# EasyEDA schematic habsat2-sstv-board.json
TITLE: Sheet_1; REV: 1.0; Date: 2023-02-08; Sheet: 2/2; Drawn By: Arkadiusz Papaj; Company: CosmoPK
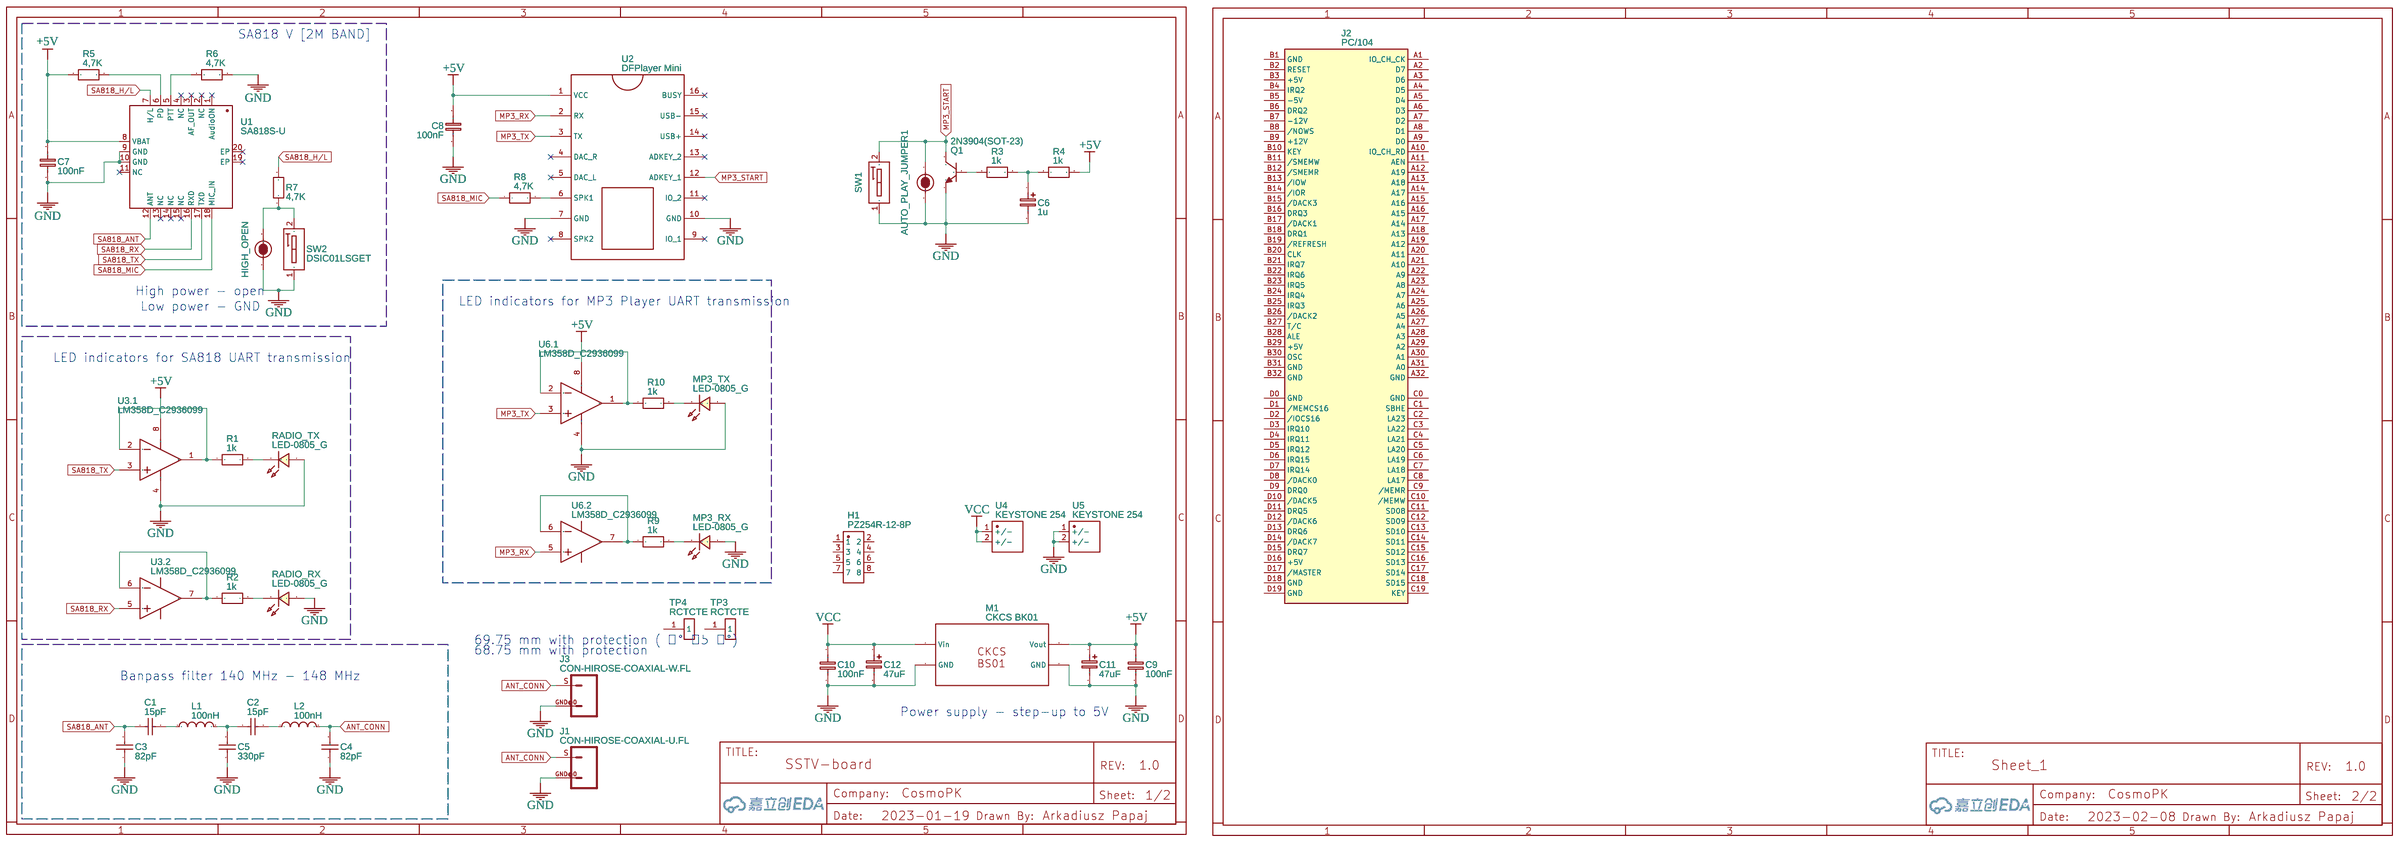
[diagram p0: schematic sheet]

## Parts
AUTO_PLAY_JUMPER1  JUMPER-PAD-2-NC_BY_PASTEFULL-BOX-SILK  [PAD-JUMPER-2-NC_BY_PASTE_YES_SILK_FULL_BOX]
C1  15pF  [C0805]
C2  15pF  [C0805]
C3  82pF  [C0805]
C4  82pF  [C0805]
C5  330pF  [C0805]
C6  1u  [CASE-B_3528]
C7  100nF  [C0805]
C8  100nF  [C0805]
C9  100nF  [C0805]
C10  100nF  [C0805]
C11  47uF  [CASE-B_3528]
C12  47uF  [CASE-B_3528]
H1  PZ254R-12-8P  [HDR-TH_8P-P2.54-H-M-R2-C4-S2.54]
HIGH_OPEN  JUMPER-PAD-2-NC_BY_PASTEFULL-BOX-SILK  [PAD-JUMPER-2-NC_BY_PASTE_YES_SILK_FULL_BOX]
J1  CON-HIROSE-COAXIAL-U.FL  [CON-U.FL]
J2  PC/104  [PC/104]
J3  CON-HIROSE-COAXIAL-W.FL  [CON-W.FL]
L1  100nH  [L1008]
L2  100nH  [L1008]
M1  CKCS BK01  [CKCS_BS01]
MP3_RX  LED-0805_G  [LED0805_GREEN]
MP3_TX  LED-0805_G  [LED0805_GREEN]
Q1  2N3904(SOT-23)  [SOT-23-3_L2.9-W1.3-P1.90-LS2.4-TR]
R1  1k  [R0805]
R2  1k  [R0805]
R3  1k  [R0805]
R4  1k  [R0805]
R5  4,7K  [R0805]
R6  4,7K  [R0805]
R7  4,7K  [R0805]
R8  4,7K  [R0805]
R9  1k  [R0805]
R10  1k  [R0805]
RADIO_RX  LED-0805_G  [LED0805_GREEN]
RADIO_TX  LED-0805_G  [LED0805_GREEN]
SW1  DSIC01LSGET  [SW-SMD_DSIC01LSGET]
SW2  DSIC01LSGET  [SW-SMD_DSIC01LSGET]
TP3  RCTCTE  [SMD-1_L2.0-W1.25-C172771]
TP4  RCTCTE  [SMD-1_L2.0-W1.25-C172771]
U1  SA818S-U  [WIRELM-SMD_G-NICERF_SA818S-X]
U2  DFPlayer Mini  [DF PLAYER MINI]
U3  LM358D_C2936099  [SO-8_L4.9-W3.9-P1.27-LS5.9-BL]  (sections 1,2)
U4  KEYSTONE 254  [BAT-SMD_MY-18650-02]
U5  KEYSTONE 254  [BAT-SMD_MY-18650-02]
U6  LM358D_C2936099  [SO-8_L4.9-W3.9-P1.27-LS5.9-BL]  (sections 1,2)

## Library data of the parts
AUTO_PLAY_JUMPER1 HIGH_OPEN = JUMPER-PAD-2-NC_BY_PASTEFULL-BOX-SILK: Contributor: SparkFun
C1 C2 = CL21C150JBANNNC: Supplier: LCSC; Manufacturer: SAMSUNG(三星); Supplier Part: C1794; JLCPCB Part Class: Extended Part
C3 C4 = 0805CG820J500NT: Supplier: LCSC; Manufacturer: FH(风华); Supplier Part: C1841; JLCPCB Part Class: Extended Part
C5 = 0805B331K500NT: Supplier: LCSC; Manufacturer: FH(风华); Supplier Part: C1737; JLCPCB Part Class: Extended Part
C6 C11 C12 = C_Tan_SMD_B_EU: Contributor: LCEDA_Lib
C7-C10 = C_0805_EU: Contributor: LCEDA_Lib
H1 = PZ254R-12-8P: Supplier: LCSC; Supplier Part: C492432; Manufacturer: XFCN(兴飞); Contributor: LCSC; JLCPCB Part Class: Extended Part
J1 = CON-HIROSE-COAXIAL-U.FL
J2 = PC/104: Contributor: andrey.shurmin
J3 = CON-HIROSE-COAXIAL-W.FL
L1 L2 = NLV25T-R10J-PF: Supplier: LCSC; Manufacturer: TDK; Supplier Part: C88522; JLCPCB Part Class: Extended Part
M1 = CKCS BK01: Contributor: detAmend
MP3_RX RADIO_RX RADIO_TX = LED-0805_G: Manufacturer: 国星光电; Manufacturer Part: NCD0805G1; Supplier Part: C84260; Contributor: LCEDA_Lib
MP3_TX = LED-0805_G: Manufacturer: 国星光电; Manufacturer Part: NCD0805G1; Supplier Part: C84260; Contributor: LCEDA_Lib; Package Display: No
Q1 = 2N3904(SOT-23): Supplier: LCSC; Manufacturer: KEC; Manufacturer Part: 2n3904S-RTK/PS; Supplier Part: C18536; Paste Type: SOT-23; Contributor: LCEDA_Lib
R1-R10 = R_0805_EU: Contributor: LCEDA_Lib
SW1 SW2 = DSIC01LSGET: Supplier: LCSC; Manufacturer: YE; Supplier Part: C54948; JLCPCB Part Class: Extended Part
TP3 TP4 = RCTCTE: Supplier: LCSC; Supplier Part: C172771; Manufacturer: KOA; Contributor: LCSC; JLCPCB Part Class: Extended Part
U1 = SA818S-U: Supplier: LCSC; Supplier Part: C3001549; Manufacturer: G-NiceRF(思为无线); link: https://atta.szlcsc.com/upload/public/pdf/source/20220425/87B569942CB193BEE2E666898149E81A.pdf; Contributor: lcsc; JLCPCB Part Class: Extended Part
U2 = DFPlayer Mini: Manufacturer: DFRobot; Manufacturer Part: DFPlayer Mini SKU DFR0299; link: https://wiki.dfrobot.com/DFPlayer_Mini_SKU_DFR0299; Contributor: Igor Milewski
U3 U6 = LM358D_C2936099: Supplier: LCSC; Supplier Part: C2936099; Manufacturer: ST(意法半导体); Manufacturer Part: LM358D; link: https://atta.szlcsc.com//upload/public/pdf/source/20220211/86857E2EABC1585834966B2A2DDBE729.pdf; subpart_no: 1; JLCPCB Part Class: Extended Part
U4 U5 = MY-18650-02: Supplier: LCSC; Supplier Part: C2979182; Manufacturer: MYOUNG(美阳); link: https://atta.szlcsc.com/upload/public/pdf/source/20220302/C8C484F04049224A79B93DF7FB83EA3E.pdf; JLCPCB Part Class: Extended Part; Contributor: lcsc

## Nets
+5V: C7.2 C8.2 C9.2 C11.1 M1.3(Vout) R4.2 R5.1 U1.8(VBAT) U2.1(VCC) U3.8(VCC+) U6.8(VCC+)
GND: AUTO_PLAY_JUMPER1.2 C3.1 C4.1 C5.1 C6.2 C7.1 C8.1 C9.1 C10.1 C11.2 C12.2 HIGH_OPEN.1 J1.GND@0(2) J3.GND@0(2) M1.2(GND) MP3_RX.1 MP3_TX.1 Q1.1(E) R6.2 RADIO_RX.1 RADIO_TX.1 SW1.1(A1) SW2.1(A1) U1.9(GND) U1.10(GND) U2.7(GND) U2.10(GND) U3.4(VCC-) U5.1(+/-) U5.2(+/-) U6.4(VCC-)
VCC: C10.2 C12.1 M1.1(Vin) U4.1(+/-) U4.2(+/-)
ANT_CONN: C4.2 J1.S(1) J3.S(1) L2.2
MP3_RX: U2.2(RX) U6.5(IN2+)
MP3_START: AUTO_PLAY_JUMPER1.1 Q1.3(C) SW1.2(A2) U2.12(ADKEY_1)
MP3_TX: U2.3(TX) U6.3(IN1+)
SA818_ANT: C1.1 C3.2 U1.12(ANT)
SA818_H/L: R7.2 U1.7(H/L)
SA818_MIC: R8.1 U1.18(MIC_IN)
SA818_RX: U1.16(RXD) U3.5(IN2+)
SA818_TX: U1.17(TXD) U3.3(IN1+)
Net-(C1-2): C1.2 L1.1
Net-(C2-1): C2.1 C5.2 L1.2
Net-(C2-2): C2.2 L2.1
Net-(C6-1): C6.1 R3.2 R4.1
Net-(HIGH_OPEN-2): HIGH_OPEN.2 R7.1 SW2.2(A2)
Net-(MP3_RX-2): MP3_RX.2 R9.2
Net-(MP3_TX-2): MP3_TX.2 R10.2
Net-(Q1-2): Q1.2(B) R3.1
Net-(R1-1): R1.1 U3.1(OUT1) U3.2(IN1-)
Net-(R1-2): R1.2 RADIO_TX.2
Net-(R2-1): R2.1 U3.6(IN2-) U3.7(OUT2)
Net-(R2-2): R2.2 RADIO_RX.2
Net-(R5-2): R5.2 U1.6(PD)
Net-(R6-1): R6.1 U1.5(PTT)
Net-(R8-2): R8.2 U2.6(SPK1)
Net-(R9-1): R9.1 U6.6(IN2-) U6.7(OUT2)
Net-(R10-1): R10.1 U6.1(OUT1) U6.2(IN1-)

Not connected (* = marked no-connect by the designer): H1 1 2 3 4 5 6 7 8; J2 A1(IO_CH_CK) A2(D7) A3(D6) A4(D5) A5(D4) A6(D3) A7(D2) A8(D1) A9(D0) A10(IO_CH_RD) A11(AEN) A12(A19) A13(A18) A14(A17) A15(A16) A16(A15) A17(A14) A18(A13) A19(A12) A20(A11) A21(A10) A22(A9) A23(A8) A24(A7) A25(A6) A26(A5) A27(A4) A28(A3) A29(A2) A30(A1) A31(A0) A32(GND) B1(GND) B2(RESET) B3(+5V) B4(IRQ2) B5(-5V) B6(DRQ2) B7(-12V) B8(/NOWS) B9(+12V) B10(KEY) B11(/SMEMW) B12(/SMEMR) B13(/IOW) B14(/IOR) B15(/DACK3) B16(DRQ3) B17(/DACK1) B18(DRQ1) B19(/REFRESH) B20(CLK) B21(IRQ7) B22(IRQ6) B23(IRQ5) B24(IRQ4) B25(IRQ3) B26(/DACK2) B27(T/C) B28(ALE) B29(+5V) B30(OSC) B31(GND) B32(GND) C0(GND) C1(SBHE) C2(LA23) C3(LA22) C4(LA21) C5(LA20) C6(LA19) C7(LA18) C8(LA17) C9(/MEMR) C10(/MEMW) C11(SD08) C12(SD09) C13(SD10) C14(SD11) C15(SD12) C16(SD13) C17(SD14) C18(SD15) C19(KEY) D0(GND) D1(/MEMCS16) D2(/IOCS16) D3(IRQ10) D4(IRQ11) D5(IRQ12) D6(IRQ15) D7(IRQ14) D8(/DACK0) D9(DRQ0) D10(/DACK5) D11(DRQ5) D12(/DACK6) D13(DRQ6) D14(/DACK7) D15(DRQ7) D16(+5V) D17(/MASTER) D18(GND) D19(GND); TP3 1; TP4 1; U1 1(AudioON)* 2(NC)* 3(AF_OUT)* 4(NC)* 11(NC)* 13(NC)* 14(NC)* 15(NC)* 19(EP)* 20(EP)*; U2 4(DAC_R)* 5(DAC_L)* 8(SPK2)* 9(IO_1)* 11(IO_2)* 13(ADKEY_2)* 14(USB+)* 15(USB-)* 16(BUSY)*

## Notes on the sheet
- SA818 V [2M BAND]
- High power - open
- Low power - GND
- LED indicators for MP3 Player UART transmission
- LED indicators for SA818 UART transmission
- 69.75 mm with protection ( ͡° ͜ʖ ͡°)
- 68.75 mm with protection
- Banpass filter 140 MHz - 148 MHz
- Power supply - step-up to 5V
